# Altium schematic sheet RFRX.SchDoc: RF Receiver 315 MHz (RFRX)
size A; Author: Kathy Grimes; Revision: 1.0; SheetNumber: 10; SheetTotal: 10
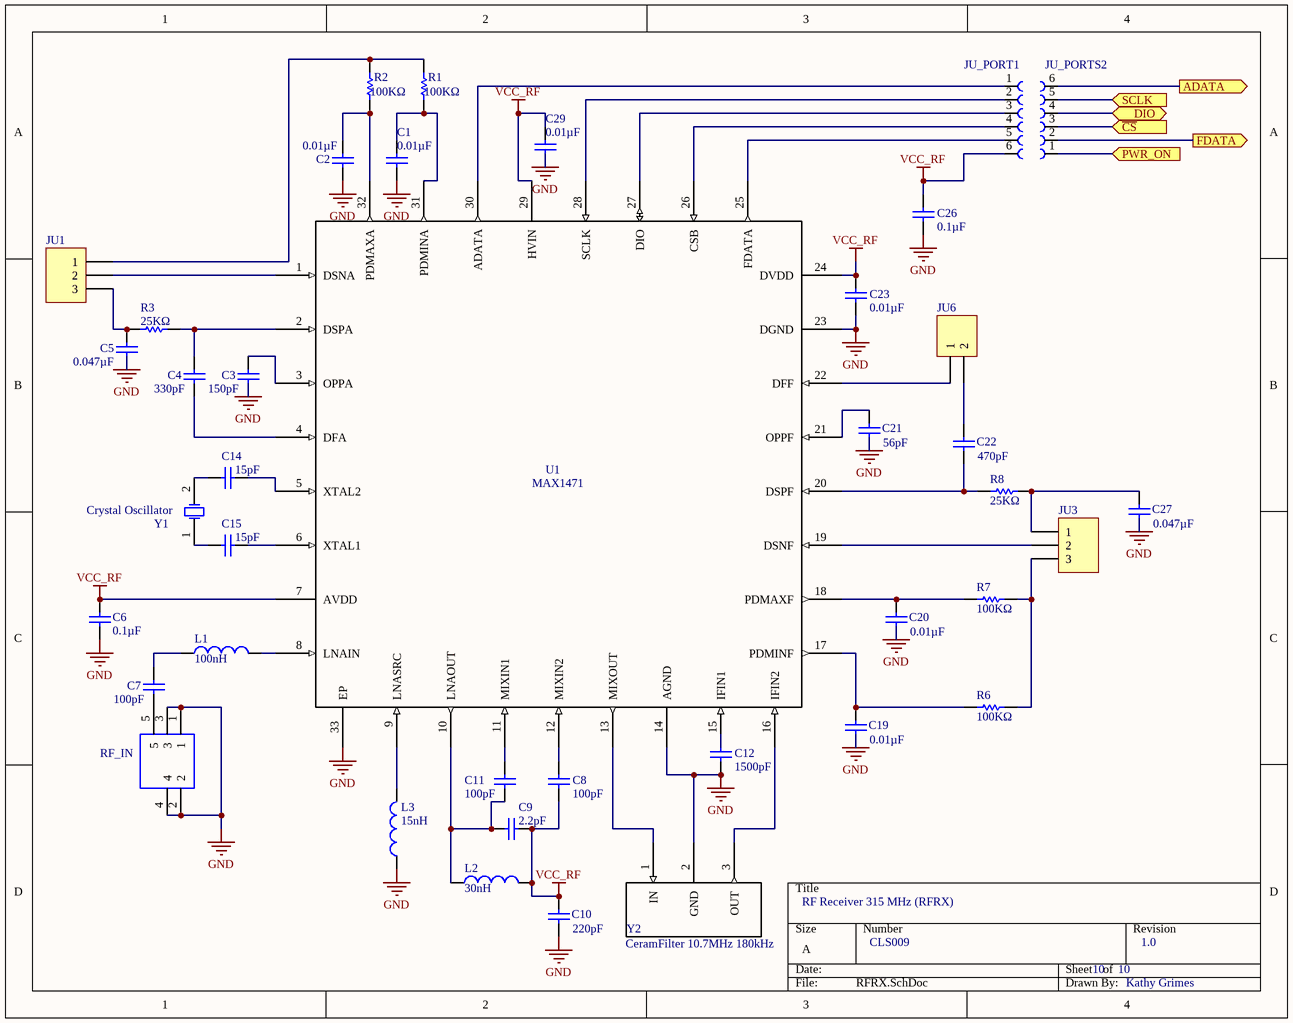
[diagram p0: RFRX.SchDoc]

## Parts
C1  value 0.01µF  [0603_CHIP_FP]  (hidden comment: Capacitor_unpolarized_0603)
C2  value 0.01µF  [0603_CHIP_FP]  (hidden comment: Capacitor_unpolarized_0603)
C3  value 150pF  [0603_CHIP_FP]  (hidden comment: Capacitor_unpolarized_0603)
C4  value 330pF  [0603_CHIP_FP]  (hidden comment: Capacitor_unpolarized_0603)
C5  value 0.047µF  [0603_CHIP_FP]  (hidden comment: Capacitor_unpolarized_0603)
C6  value 0.1µF  [0603_CHIP_FP]  (hidden comment: Capacitor_unpolarized_0603)
C7  value 100pF  [0603_CHIP_FP]  (hidden comment: Capacitor_unpolarized_0603)
C8  value 100pF  [0603_CHIP_FP]  (hidden comment: Capacitor_unpolarized_0603)
C9  value 2.2pF  [0603_CHIP_FP]  (hidden comment: Capacitor_unpolarized_0603)
C10  value 220pF  [0603_CHIP_FP]  (hidden comment: Capacitor_unpolarized_0603)
C11  value 100pF  [0603_CHIP_FP]  (hidden comment: Capacitor_unpolarized_0603)
C12  value 1500pF  [0603_CHIP_FP]  (hidden comment: Capacitor_unpolarized_0603)
C14  value 15pF  [0603_CHIP_FP]  (hidden comment: Capacitor_unpolarized_0603)
C15  value 15pF  [0603_CHIP_FP]  (hidden comment: Capacitor_unpolarized_0603)
C19  value 0.01µF  [0603_CHIP_FP]  (hidden comment: Capacitor_unpolarized_0603)
C20  value 0.01µF  [0603_CHIP_FP]  (hidden comment: Capacitor_unpolarized_0603)
C21  value 56pF  [0603_CHIP_FP]  (hidden comment: Capacitor_unpolarized_0603)
C22  value 470pF  [0603_CHIP_FP]  (hidden comment: Capacitor_unpolarized_0603)
C23  value 0.01µF  [0603_CHIP_FP]  (hidden comment: Capacitor_unpolarized_0603)
C26  value 0.1µF  [0603_CHIP_FP]  (hidden comment: Capacitor_unpolarized_0603)
C27  value 0.047µF  [0603_CHIP_FP]  (hidden comment: Capacitor_unpolarized_0603)
C29  value 0.01µF  [0603_CHIP_FP]  (hidden comment: Capacitor_unpolarized_0603)
CeramFilter_10.7MHz_180kHz  Y2  [SFECV10M7CQ0C01R0]
Crystal_Oscillator  Y1  [XTAL_ECS-100-18-4X]
JU1  Header 3  [HDR1X3]  (value not drawn)
JU3  Header 3  [HDR1X3]  (value not drawn)
JU6  Header 2  [HDR1X2]  (value not drawn)
JU_PORT1  61300611121  [61300611121]  (value not drawn)
JU_PORTS2  61300611121  [61300611121]  (value not drawn)
L1  value 100nH  [0603_CHIP_FP]  (hidden comment: Inductor)
L2  value 30nH  [0603_CHIP_FP]  (hidden comment: Inductor)
L3  value 15nH  [0603_CHIP_FP]  (hidden comment: Inductor)
R1  value 100KΩ  [0603_CHIP_FP]  (hidden comment: Resistor)
R2  value 100KΩ  [0603_CHIP_FP]  (hidden comment: Resistor)
R3  value 25KΩ  [0603_CHIP_FP]  (hidden comment: Resistor)
R6  value 100KΩ  [0603_CHIP_FP]  (hidden comment: Resistor)
R7  value 100KΩ  [0603_CHIP_FP]  (hidden comment: Resistor)
R8  value 25KΩ  [0603_CHIP_FP]  (hidden comment: Resistor)
RF_IN  142-0701-201  [142-0701-201]  (value not drawn)
U1  MAX1471  [QFN50P500X500X80-33N]

## Ports
ADATA (out), DIO (bidir), FDATA (out), PWR_ON (in), SCLK (in), ~{CS} (in)

## Nets
GND: C1.1 C2.1 C3.2 C5.1 C6.2 C10.1 C12.1 C19.1 C20.1 C21.1 C23.1 C26.1 C27.1 C29.1 CeramFilter_10.7MHz_180kHz.2(GND) L3.1 RF_IN.1 RF_IN.2 RF_IN.3 RF_IN.4 U1.14(AGND) U1.23(DGND) U1.33(EP)
VCC_RF: C6.1 C8.1 C9.1 C10.2 C23.2 C26.2 C29.2 JU_PORT1.6 L2.2 U1.7(AVDD) U1.24(DVDD) U1.29(HVIN)
ADATA: JU_PORTS2.6 ; port ADATA
~{CS}: JU_PORTS2.3 ; port ~{CS}
DIO: JU_PORTS2.4 ; port DIO
FDATA: JU_PORTS2.2 ; port FDATA
PWR_ON: JU_PORTS2.1 ; port PWR_ON
SCLK: JU_PORTS2.5 ; port SCLK
NetC1_2: C1.2 R1.1 U1.31(PDMINA)
NetC2_2: C2.2 R2.1 U1.32(PDMAXA)
NetC3_1: C3.1 U1.3(OPPA)
NetC4_1: C4.1 R3.1 U1.2(DSPA)
NetC4_2: C4.2 U1.4(DFA)
NetC5_2: C5.2 JU1.3 R3.2
NetC7_1: C7.1 L1.1
NetC7_2: C7.2 RF_IN.5
NetC8_2: C8.2 U1.12(MIXIN2)
NetC9_2: C9.2 C11.1 L2.1 U1.10(LNAOUT)
NetC11_2: C11.2 U1.11(MIXIN1)
NetC12_2: C12.2 U1.15(IFIN1)
NetC14_1: C14.1 U1.5(XTAL2)
NetC14_2: C14.2 Crystal_Oscillator.2(OSC2)
NetC15_1: C15.1 U1.6(XTAL1)
NetC15_2: C15.2 Crystal_Oscillator.1(OSC1)
NetC19_2: C19.2 R6.2 U1.17(PDMINF)
NetC20_2: C20.2 R7.2 U1.18(PDMAXF)
NetC21_2: C21.2 U1.21(OPPF)
NetC22_1: C22.1 R8.2 U1.20(DSPF)
NetC22_2: C22.2 JU6.2
NetC27_2: C27.2 JU3.1 R8.1
NetCeramFilter_10.7MHz_180kHz_1: CeramFilter_10.7MHz_180kHz.1(IN) U1.13(MIXOUT)
NetCeramFilter_10.7MHz_180kHz_3: CeramFilter_10.7MHz_180kHz.3(OUT) U1.16(IFIN2)
NetJU1_1: JU1.1 R1.2 R2.2
NetJU1_2: JU1.2 U1.1(DSNA)
NetJU3_2: JU3.2 U1.19(DSNF)
NetJU3_3: JU3.3 R6.1 R7.1
NetJU6_1: JU6.1 U1.22(DFF)
NetJU_PORT1_1: JU_PORT1.1 U1.30(ADATA)
NetJU_PORT1_2: JU_PORT1.2 U1.28(SCLK)
NetJU_PORT1_3: JU_PORT1.3 U1.27(DIO)
NetJU_PORT1_4: JU_PORT1.4 U1.26(CSB)
NetJU_PORT1_5: JU_PORT1.5 U1.25(FDATA)
NetL1_2: L1.2 U1.8(LNAIN)
NetL3_2: L3.2 U1.9(LNASRC)

## Notes on the sheet
- CLS009

## Library data of the parts
C1 C2 C19 C20 C23 C29 = Capacitor_unpolarized_0603: CAP CER 10000PF 50V X7R 0603; Manufacturer: Murata Electronics North America; Manufacturer Part Number: GCM188R71H103KA37D; Vendor Part Number: 490-4778-1-ND; Vendor: Digikey; ComponentLink1Description: Datasheet; ComponentLink1URL: https://www.digikey.com/product-detail/en/murata-electronics-north-america/GCM188R71H103KA37D/490-4778-1-ND/1641697; Cost: .071; Vendor Description: CAP CER 10000PF 50V X7R 0603
C3 = Capacitor_unpolarized_0603: CAP CER 150PF 100V C0G/NP0 0603; Manufacturer: Murata Electronics North America; Manufacturer Part Number: GCM1885C2A151JA16D; Vendor Part Number: 490-4946-1-ND; Vendor: Digikey; ComponentLink1Description: Datasheet; ComponentLink1URL: https://www.digikey.com/product-detail/en/murata-electronics-north-america/GCM1885C2A151JA16D/490-4946-1-ND/1765265; Cost: .15; Vendor Description: CAP CER 150PF 100V C0G/NP0 0603
C4 = Capacitor_unpolarized_0603: CAP CER 330PF 100V C0G/NP0 0603; Manufacturer: Murata Electronics North America; Manufacturer Part Number: GCM1885C2A331JA16D; Vendor Part Number: 490-4948-1-ND; Vendor: Digikey; ComponentLink1Description: Datasheet; ComponentLink1URL: https://www.digikey.com/products/en/capacitors/ceramic-capacitors/60?k=&pkeyword=&pv2049=u330pF&pv3=1&pv3=4&pv3=2&sf=0&FV=fffc01ea%2Cfffc0227%2Cfffc1f73%2C1c0002%2C400005%2C11401c5%2C3f0007c%2C3f00019%2C3f0001b%2C3f00028%2C3f0003f%2C1f140000%2Cffe0003c&quantity=&ColumnSort=-1000002&page=1&pageSize=25; Cost: .19; Vendor Description: CAP CER 330PF 100V C0G/NP0 0603
C5 C27 = Capacitor_unpolarized_0603: CAP CER 0.047UF 25V X7R 0603; Manufacturer: Murata Electronics North America; Manufacturer Part Number: GRM188R71E473JA01D; Vendor Part Number: 490-11528-1-ND; Vendor: Digikey; ComponentLink1Description: Datasheet; ComponentLink1URL: https://www.digikey.com/product-detail/en/murata-electronics-north-america/GRM188R71E473JA01D/490-11528-1-ND/5333368; Cost: .112; Vendor Description: CAP CER 0.047UF 25V X7R 0603
C6 C26 = Capacitor_unpolarized_0603: CAP CER 0.1UF 100V X7R 0603; Manufacturer: Murata Electronics North America; Manufacturer Part Number: GRM188R72A104KA35D; Vendor Part Number: 490-3285-1-ND; Vendor: Digikey; ComponentLink1Description: Datasheet; ComponentLink1URL: https://www.digikey.com/product-detail/en/murata-electronics-north-america/GRM188R72A104KA35D/490-3285-1-ND/702826; Cost: .201; Vendor Description: CAP CER 0.1UF 100V X7R 0603
C7 C8 C11 = Capacitor_unpolarized_0603: CAP CER 100PF 100V C0G/NP0 0603; Manufacturer: Murata Electronics North America; Manufacturer Part Number: GCM1885C2A101JA16D; Vendor Part Number: 490-4771-1-ND; Vendor: Digikey; ComponentLink1Description: Datasheet; ComponentLink1URL: https://www.digikey.com/product-detail/en/murata-electronics-north-america/GCM1885C2A101JA16D/490-4771-1-ND/1641690; Cost: .097; Vendor Description: CAP CER 100PF 100V C0G/NP0 0603
C9 = Capacitor_unpolarized_0603: CAP CER 2.2PF 100V C0G/NP0 0603; Manufacturer: Murata Electronics North America; Manufacturer Part Number: GQM1885C2A2R2BB01D; Vendor Part Number: 490-4838-1-ND; Vendor: Digikey; ComponentLink1Description: Datasheet; ComponentLink1URL: https://www.digikey.com/product-detail/en/murata-electronics-north-america/GQM1885C2A2R2BB01D/490-4838-1-ND/1687484; Cost: .74; Vendor Description: CAP CER 2.2PF 100V C0G/NP0 0603
C10 = Capacitor_unpolarized_0603: CAP CER 220PF 100V X7R 0603; Manufacturer: Murata Electronics North America; Manufacturer Part Number: GRM188R72A221KA01D; Vendor Part Number: 490-1460-1-ND; Vendor: Digikey; ComponentLink1Description: Datasheet; ComponentLink1URL: https://www.digikey.com/product-detail/en/murata-electronics-north-america/GRM188R72A221KA01D/490-1460-1-ND/587749; Cost: .092; Vendor Description: CAP CER 220PF 100V X7R 0603
C12 = Capacitor_unpolarized_0603: CAP CER 1500PF 100V X7R 0603; Manufacturer: Murata Electronics North America; Manufacturer Part Number: GRM188R72A152KA01D; Vendor Part Number: 490-1475-1-ND; Vendor: Digikey; ComponentLink1Description: Datasheet; ComponentLink1URL: https://www.digikey.com/product-detail/en/murata-electronics-north-america/GRM188R72A152KA01D/490-1475-1-ND/587850; Cost: .13; Vendor Description: CAP CER 1500PF 100V X7R 0603
C14 C15 = Capacitor_unpolarized_0603: CAP CER 15PF 50V C0G/NP0 0603; Manufacturer: Murata Electronics North America; Manufacturer Part Number: GQM1885C1H150JB01D; Vendor Part Number: 490-3572-1-ND; Vendor: Digikey; ComponentLink1Description: Datasheet; ComponentLink1URL: https://www.digikey.com/product-detail/en/murata-electronics-north-america/GQM1885C1H150JB01D/490-3572-1-ND/789572; Cost: .581; Vendor Description: CAP CER 15PF 50V C0G/NP0 0603
C21 = Capacitor_unpolarized_0603: CAP CER 56PF 100V C0G/NP0 0603; Manufacturer: Murata Electronics North America; Manufacturer Part Number: GCM1885C2A560JA16D; Vendor Part Number: 490-17769-1-ND; Vendor: Digikey; ComponentLink1Description: Datasheet; ComponentLink1URL: https://www.digikey.com/product-detail/en/murata-electronics-north-america/GCM1885C2A560JA16D/490-17769-1-ND/8540005; Cost: .12; Vendor Description: CAP CER 56PF 100V C0G/NP0 0603
C22 = Capacitor_unpolarized_0603: CAP CER 470PF 100V C0G/NP0 0603; Manufacturer: Murata Electronics North America; Manufacturer Part Number: GCM1885C2A471JA16D; Vendor Part Number: 490-4949-1-ND; Vendor: Digikey; ComponentLink1Description: Datasheet; ComponentLink1URL: https://www.digikey.com/products/en/capacitors/ceramic-capacitors/60?k=&pkeyword=&pv2049=u470pF&pv3=1&pv3=4&pv3=2&sf=0&FV=fffc01ea%2Cfffc0227%2Cfffc1f73%2C1c0002%2C400005%2C11401c5%2C3f0007c%2C3f00019%2C3f0001b%2C3f00028%2C3f0003f%2C1f140000%2Cffe0003c&quantity=&ColumnSort=-1000002&page=1&pageSize=25; Cost: .166; Vendor Description: CAP CER 470PF 100V C0G/NP0 0603
CeramFilter_10.7MHz_180kHz = Component_1: Signal Conditioning 10.7MHZ 330 OHM CERA; Manufacturer: Murata Electronics; Manufacturer Part Number: SFECV10M7FA00-R0; Vendor Part Number: 81-SFECV10M7FA00-R0; Vendor: Mouser; ComponentLink1Description: Datasheet; ComponentLink1URL: https://www.mouser.com/ProductDetail/Murata-Electronics/SFECV10M7FA00-R0?qs=sGAEpiMZZMtMMXztyU6kdIFTJJQM3M6Q8oelu8IKNP4%3d; Cost: .99; Vendor Description: Signal Conditioning 10.7MHZ 330 OHM CERA
Crystal_Oscillator = XTAL: Manufacturer: ECS Inc.; Manufacturer Part Number: ECS-95.4-S-4; Vendor Part Number: X420-ND; Vendor: Digikey; Vendor Description: CRYSTAL 9.5450MHZ SERIES T/H; ComponentLink1Description: Datasheet; ComponentLink1URL: https://www.digikey.com/product-detail/en/ecs-inc/ECS-95.4-S-4/X420-ND/79307; Cost: .69
JU1 JU3 = Header 3: CONN HEADER .100 SINGL STR 36POS; Vendor Part Number: PRT-00116; Vendor: Digikey; Vendor Description: .100 mil pitch male header x3; ComponentLink1Description: Datasheet; ComponentLink1URL: https://www.digikey.com/product-detail/en/sullins-connector-solutions/PEC36SAAN/S1012E-36-ND/859153; Cost: bulk
JU6 = Header 2: CONN HEADER .100 SINGL STR 36POS; Vendor Part Number: PRT-00116; Vendor: Digikey; Vendor Description: .100 mil pitch male header x2; ComponentLink1Description: Datasheet; ComponentLink1URL: https://www.digikey.com/product-detail/en/sullins-connector-solutions/PEC36SAAN/S1012E-36-ND/859153; Cost: bulk
JU_PORT1 JU_PORTS2 = 61300611121: Board-To-Board Connector, Vertical, WR-PHD Series, Through Hole, Header, 6, 2.54 mm; Manufacturer: CONN HEADER 6 POS 2.54; Vendor Part Number: 732-5319-ND; MF: Wurth Electronics; Vendor: Digikey; Vendor Description: CONN HEADER 6 POS 2.54 x2; MP: 61300611121; Availability: Unavailable; SnapEDA_Link: https://www.snapeda.com/parts/61300611121/Wurth%20Electronics%20Inc./view-part/?ref=snap; Package: None; Price: None; Value: *; ComponentLink1Description: Datasheet; ComponentLink1URL: https://www.digikey.com/products/en?keywords=732-5319-ND; Cost: .33; Manufacturer Part Number: 61300611121
L1 = Inductor: FIXED IND 100NH 220MA 680 MOHM; Manufacturer: Murata Electronics North America; Manufacturer Part Number: LQW18ANR10J00D; Vendor Part Number: 490-1179-1-ND; Vendor: Digikey; ComponentLink1Description: Datasheet; ComponentLink1URL: https://www.digikey.com/product-detail/en/murata-electronics-north-america/LQW18ANR10J00D/490-1179-1-ND/584624; Cost: .17; Vendor Description: FIXED IND 100NH 220MA 680 MOHM
L2 = Inductor: FIXED IND 30NH 420MA 230 MOHM; Manufacturer: Murata Electronics North America; Manufacturer Part Number: LQW18AN30NJ00D; Vendor Part Number: 490-6883-1-ND; Vendor: Digikey; ComponentLink1Description: Datasheet; ComponentLink1URL: https://www.digikey.ca/product-detail/en/murata-electronics-north-america/LQW18AN30NJ00D/490-6883-1-ND/3846080; Cost: .25; Vendor Description: FIXED IND 30NH 420MA 230 MOHM
L3 = Inductor: FIXED IND 15NH 600MA 130 MOHM; Manufacturer: Murata Electronics North America; Manufacturer Part Number: LQW18AN15NG00D; Vendor Part Number: 490-6866-1-ND; Vendor: Digikey; ComponentLink1Description: Datasheet; ComponentLink1URL: https://www.digikey.com/product-detail/en/murata-electronics-north-america/LQW18AN15NG00D/490-6866-1-ND/3846063; Cost: .19; Vendor Description: FIXED IND 15NH 600MA 130 MOHM
R1 R2 R6 R7 = Resistor_0603: RES SMD 100K OHM 1% 1/4W 0603; Manufacturer: Rohm Semiconductor; Manufacturer Part Number: ESR03EZPF1003; Vendor Part Number: RHM100KADCT-ND; Vendor: Digikey; ComponentLink1Description: Datasheet; ComponentLink1URL: https://www.digikey.com/product-detail/en/rohm-semiconductor/ESR03EZPF1003/RHM100KADCT-ND/1983754; Cost: .126; Vendor Description: RES SMD 100K OHM 1% 1/4W 0603
R3 R8 = Resistor_0603: Thin Film Resistors 150mW 25Kohms .1% 25ppm; Manufacturer: Vishay / Thin Film; Manufacturer Part Number: PNM0603E2502BST1; Vendor Part Number: 71-PNM0603E2502BST1; Vendor: Mouser; Vendor Description: Thin Film Resistors - SMD 150mW 25Kohms .1% 25ppm; ComponentLink1Description: Datasheet; ComponentLink1URL: https://www.mouser.com/ProductDetail/Vishay-Thin-Film/PNM0603E2502BST1?qs=sGAEpiMZZMvdGkrng054t3MM9KQf0jCWaRJtMFekKwY%3d; Cost: 1.75
RF_IN = 142-0701-201: CONN SMA JACK STR 50 OHM PCB; Manufacturer: Cinch Connectivity Solutions Johnson; Vendor Part Number: J500-ND; Vendor: Digikey; ComponentLink1Description: Datasheet; ComponentLink1URL: https://www.digikey.com/product-detail/en/cinch-connectivity-solutions-johnson/142-0701-201/J500-ND/35274; Cost: 2.79; Manufacturer Part Number: 142-0701-201; Vendor Description: CONN SMA JACK STR 50 OHM PCB
U1 = Component_1: RF Receiver 315MHz/434MHz Superheterodyne Rcvr; Manufacturer: Maxim Integrated; Manufacturer Part Number: MAX1471ATJ+; Vendor Part Number: 700-MAX1471ATJ; Vendor: Mouser; ComponentLink1Description: Datasheet; ComponentLink1URL: https://www.mouser.com/ProductDetail/Maxim-Integrated/MAX1471ATJ%2b?qs=sGAEpiMZZMvxLC1VZo1hVoB57gDFwOQL7RpsI8wlcxI%3d; Cost: 6.54; Vendor Description: RF Receiver 315MHz/434MHz Superheterodyne Rcvr